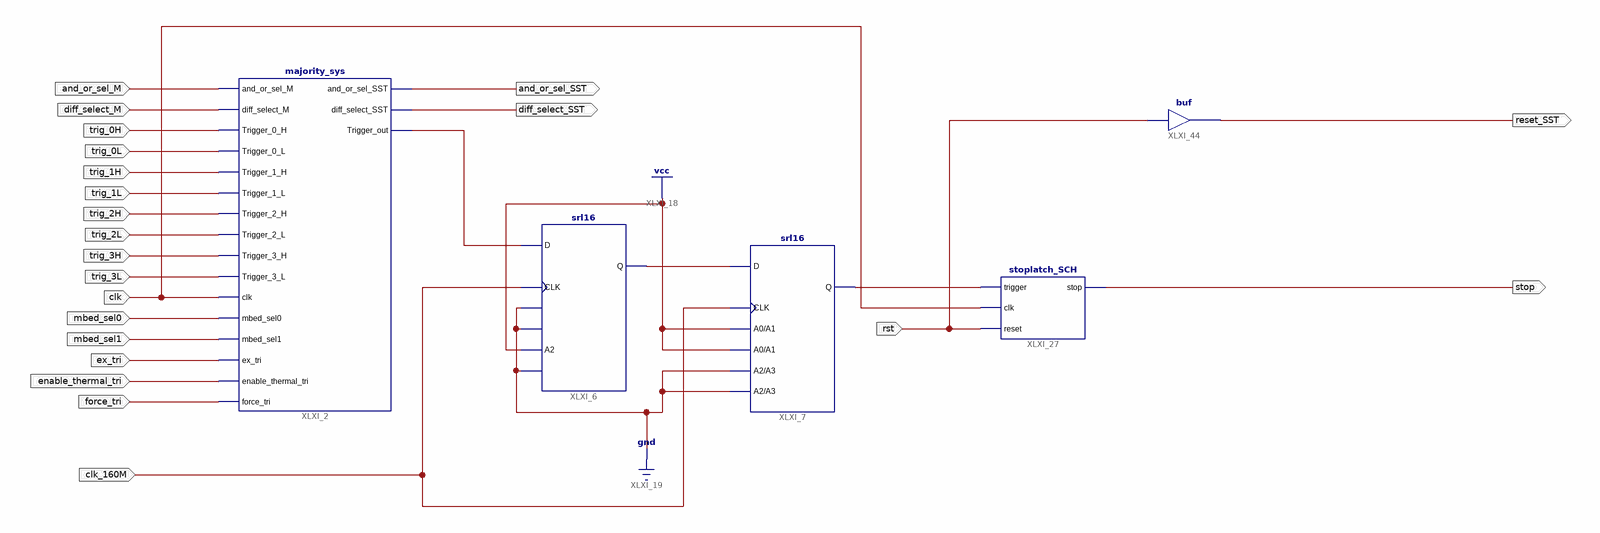
[diagram p0: schematic sheet 1]
// Xilinx ISE schematic stop_gen_block.sch (spartan3a) as structural Verilog: 5 symbols, 22 ports
module stop_gen_block (
  input  force_tri,
  input  enable_thermal_tri,
  input  ex_tri,
  input  mbed_sel1,
  input  mbed_sel0,
  input  trig_3L,
  input  trig_3H,
  input  trig_2L,
  input  trig_2H,
  input  trig_1L,
  input  trig_1H,
  input  trig_0L,
  input  trig_0H,
  input  diff_select_M,
  input  and_or_sel_M,
  input  clk,
  input  rst,
  input  clk_160M,
  output and_or_sel_SST,
  output diff_select_SST,
  output stop,
  output reset_SST
);

  wire XLXN_51, XLXN_109, XLXN_121;

  srl16 XLXI_6 (.A0(1'b0), .A1(1'b0), .A2(1'b1), .A3(1'b0), .CLK(clk_160M), .D(XLXN_109), .Q(XLXN_51));
  majority_sys XLXI_2 (
    .Trigger_0_H(trig_0H), .Trigger_0_L(trig_0L), .Trigger_1_H(trig_1H), .Trigger_1_L(trig_1L),
    .Trigger_2_H(trig_2H), .Trigger_2_L(trig_2L), .Trigger_3_H(trig_3H), .Trigger_3_L(trig_3L), .clk(clk),
    .mbed_sel0(mbed_sel0), .mbed_sel1(mbed_sel1), .ex_tri(ex_tri), .enable_thermal_tri(enable_thermal_tri),
    .force_tri(force_tri), .and_or_sel_M(and_or_sel_M), .diff_select_M(diff_select_M),
    .and_or_sel_SST(and_or_sel_SST), .diff_select_SST(diff_select_SST), .Trigger_out(XLXN_109));
  srl16 XLXI_7 (.A0(1'b1), .A1(1'b1), .A2(1'b0), .A3(1'b0), .CLK(clk_160M), .D(XLXN_51), .Q(XLXN_121));
  stoplatch_SCH XLXI_27 (.trigger(XLXN_121), .clk(clk), .reset(rst), .stop(stop));
  buf XLXI_44 (reset_SST, rst);
endmodule
